# EAGLE schematic ScannerControlsBreakout (EAGLE 6.3)
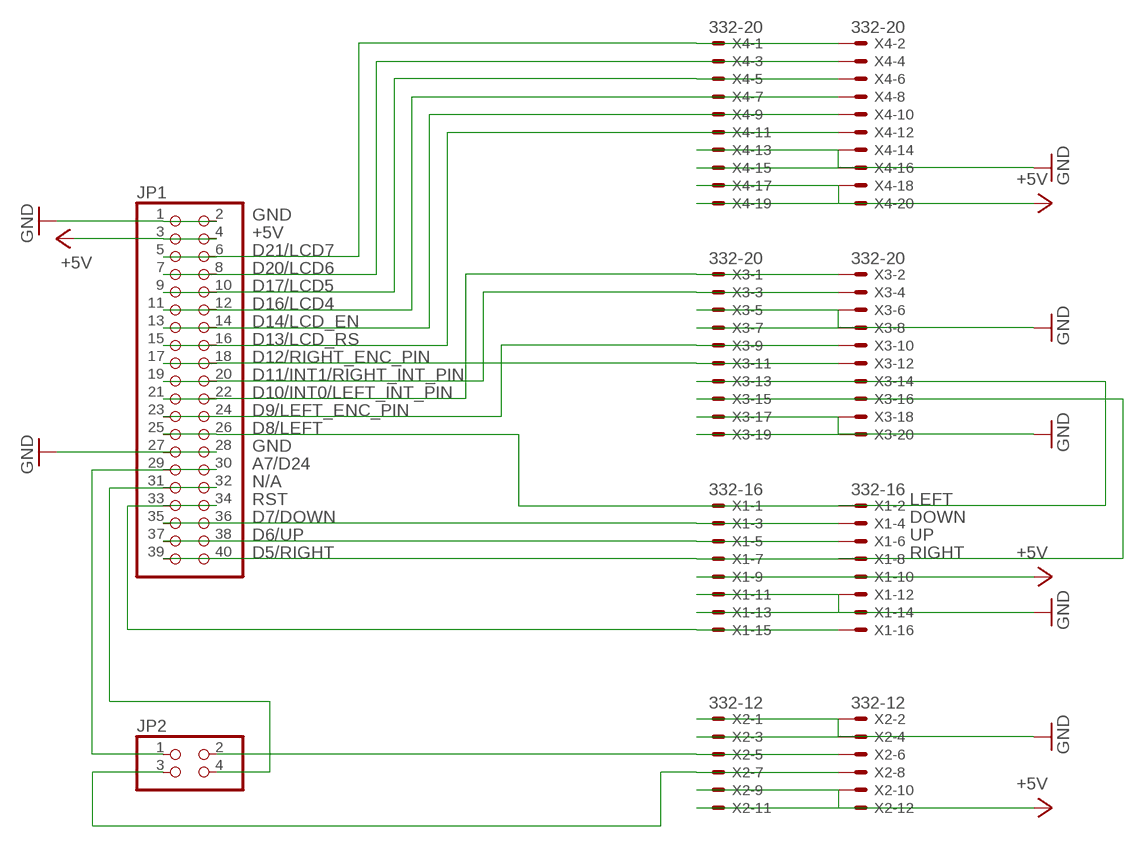
[diagram p0: schematic, sheet 1]

## Parts
JP1  PINHD-2X20  [2X20]
JP2  PINHD-2X2  [2X02]
X1  332-16  [332-16]
X2  332-12  [332-12]
X3  332-20  [332-20]
X4  332-20  [332-20]

## Nets
+5V: JP1.3 JP1.4 X1.9 X1.10 X2.9 X2.10 X2.11 X2.12 X4.17 X4.18 X4.19 X4.20
DOWN: JP1.35 JP1.36 X1.3 X1.4
GND: JP1.1 JP1.2 JP1.27 JP1.28 X1.11 X1.12 X1.13 X1.14 X2.1 X2.2 X2.3 X2.4 X3.5 X3.6 X3.7 X3.8 X3.17 X3.18 X3.19 X3.20 X4.13 X4.14 X4.15 X4.16
LEFT: JP1.25 JP1.26 X1.1 X1.2 X3.13 X3.14
N$1: JP2.3 X2.7 X2.8
N$6: JP1.15 JP1.16 X4.11 X4.12
N$7: JP1.13 JP1.14 X4.9 X4.10
N$8: JP1.11 JP1.12 X4.7 X4.8
N$10: JP1.7 JP1.8 X4.3 X4.4
N$16: JP1.31 JP1.32 JP2.4
N$23: JP1.29 JP1.30 JP2.1
N$31: JP2.2 X2.5 X2.6
N$35: JP1.21 JP1.22 X3.1 X3.2
N$36: JP1.19 JP1.20 X3.3 X3.4
N$39: JP1.23 JP1.24 X3.9 X3.10
N$40: JP1.17 JP1.18 X3.11 X3.12
N$45: JP1.5 JP1.6 X4.1 X4.2
N$47: JP1.9 JP1.10 X4.5 X4.6
RIGHT: JP1.39 JP1.40 X1.7 X1.8 X3.15 X3.16
RST: JP1.33 JP1.34 X1.15 X1.16
UP: JP1.37 JP1.38 X1.5 X1.6

## Notes on the sheet
- GND
- +5V
- D21/LCD7
- D20/LCD6
- D17/LCD5
- D16/LCD4
- D14/LCD_EN
- D13/LCD_RS
- D12/RIGHT_ENC_PIN
- D11/INT1/RIGHT_INT_PIN
- D10/INT0/LEFT_INT_PIN
- D9/LEFT_ENC_PIN
- D8/LEFT
- GND
- A7/D24
- N/A
- RST | LEFT
- D7/DOWN | DOWN
- D6/UP | UP
- D5/RIGHT | RIGHT

## Library data of the parts
JP1 = pinhead:PINHD-2X20: PIN HEADER
JP2 = pinhead:PINHD-2X2: PIN HEADER
X1 = con-garry:332-16: 16 Pin - 2mm Dual Row Source: www.mpe-connector.de / garry_shortform_2012.pdf
X2 = con-garry:332-12: 12 Pin - 2mm Dual Row Source: www.mpe-connector.de / garry_shortform_2012.pdf
X3 X4 = con-garry:332-20: 20 Pin - 2mm Dual Row Source: www.mpe-connector.de / garry_shortform_2012.pdf